# Altium schematic sheet TopLevel.SchDoc: =project_title
size Tabloid; CompanyName: Luxonis Holding; Organization: Luxonis Holding; Address1: 1925 Harmony Park Drive; Address2: Westminster, CO; Address3: 80234; Address4: United States; SheetNumber: 1; SheetTotal: 8
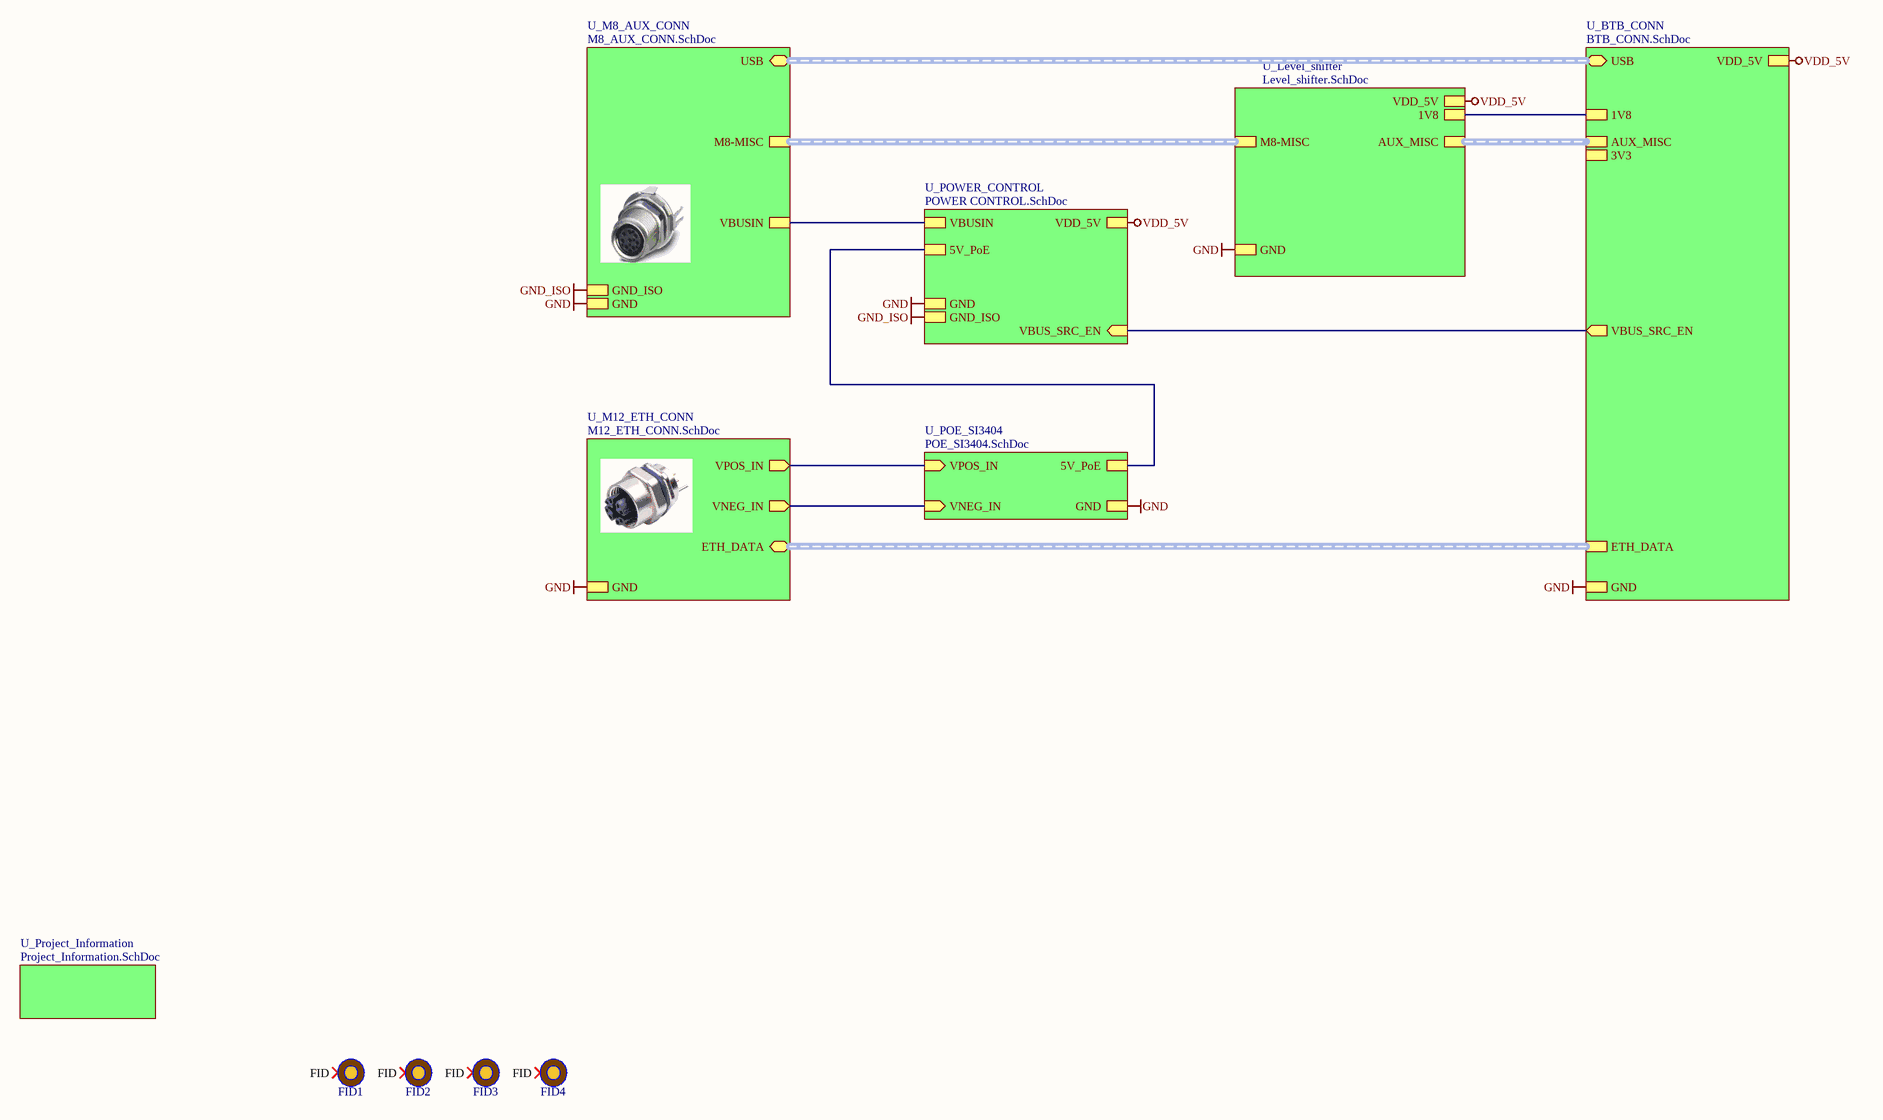
[diagram p0: TopLevel.SchDoc]

## Parts
FID1  FIDUCIAL_ROUND_1MM  [FIDUCIAL_ROUND_1MM]  (value not drawn)  (no BOM)
FID2  FIDUCIAL_ROUND_1MM  [FIDUCIAL_ROUND_1MM]  (value not drawn)  (no BOM)
FID3  FIDUCIAL_ROUND_1MM  [FIDUCIAL_ROUND_1MM]  (value not drawn)  (no BOM)
FID4  FIDUCIAL_ROUND_1MM  [FIDUCIAL_ROUND_1MM]  (value not drawn)  (no BOM)

## Sub-sheets
U_BTB_CONN = BTB_CONN.SchDoc: GND, ETH_DATA (harness ETH_DATA), VDD_5V, 1V8, USB (bidir, harness USB), 3V3, AUX_MISC (harness AUX_MISC), VBUS_SRC_EN (out)
U_Level_shifter = Level_shifter.SchDoc: VDD_5V, 1V8, GND, AUX_MISC (harness AUX_MISC), M8-MISC (harness M8-MISC)
U_M8_AUX_CONN = M8_AUX_CONN.SchDoc: GND, VBUSIN, USB (bidir, harness USB), GND_ISO, M8-MISC (harness M8-MISC)
U_M12_ETH_CONN = M12_ETH_CONN.SchDoc: VPOS_IN (out), VNEG_IN (out), ETH_DATA (bidir, harness ETH_DATA), GND
U_POE_SI3404 = POE_SI3404.SchDoc: 5V_PoE, GND, VPOS_IN (in), VNEG_IN (in)
U_POWER_CONTROL = POWER CONTROL.SchDoc: VDD_5V, GND_ISO, GND, 5V_PoE, VBUSIN, VBUS_SRC_EN (in)
U_Project_Information = Project_Information.SchDoc: no entries

## Nets
GND: sheet U_M12_ETH_CONN/GND, sheet U_POE_SI3404/GND, sheet U_M8_AUX_CONN/GND, sheet U_BTB_CONN/GND, sheet U_POWER_CONTROL/GND, sheet U_Level_shifter/GND
GND_ISO: sheet U_M8_AUX_CONN/GND_ISO, sheet U_POWER_CONTROL/GND_ISO
VDD_5V: sheet U_BTB_CONN/VDD_5V, sheet U_POWER_CONTROL/VDD_5V, sheet U_Level_shifter/VDD_5V
(unnamed): sheet U_M12_ETH_CONN/VPOS_IN, sheet U_POE_SI3404/VPOS_IN
(unnamed): sheet U_M12_ETH_CONN/VNEG_IN, sheet U_POE_SI3404/VNEG_IN
(unnamed): sheet U_POE_SI3404/5V_PoE, sheet U_POWER_CONTROL/5V_PoE
(unnamed): sheet U_M8_AUX_CONN/VBUSIN, sheet U_POWER_CONTROL/VBUSIN
(unnamed): sheet U_BTB_CONN/1V8, sheet U_Level_shifter/1V8
(unnamed): sheet U_BTB_CONN/VBUS_SRC_EN, sheet U_POWER_CONTROL/VBUS_SRC_EN

Not connected (* = marked no-connect by the designer): FID1 FID*; FID2 FID*; FID3 FID*; FID4 FID*

## Buses and harness runs
harness sheet U_BTB_CONN/AUX_MISC = sheet U_Level_shifter/AUX_MISC
harness sheet U_BTB_CONN/ETH_DATA = sheet U_M12_ETH_CONN/ETH_DATA
harness sheet U_BTB_CONN/USB = sheet U_M8_AUX_CONN/USB
harness sheet U_Level_shifter/M8-MISC = sheet U_M8_AUX_CONN/M8-MISC

## Notes on the sheet
- Title
- Size:
- Date:
- Tabloid
- Number:
- Time:
- Revision:
- Sheet
- of
- Drawn by:

## Library data of the parts
FID1-FID4 = FIDUCIAL: Fiducial with various available footprints